# EAGLE schematic Valve_with_oc (EAGLE 8.2.2)
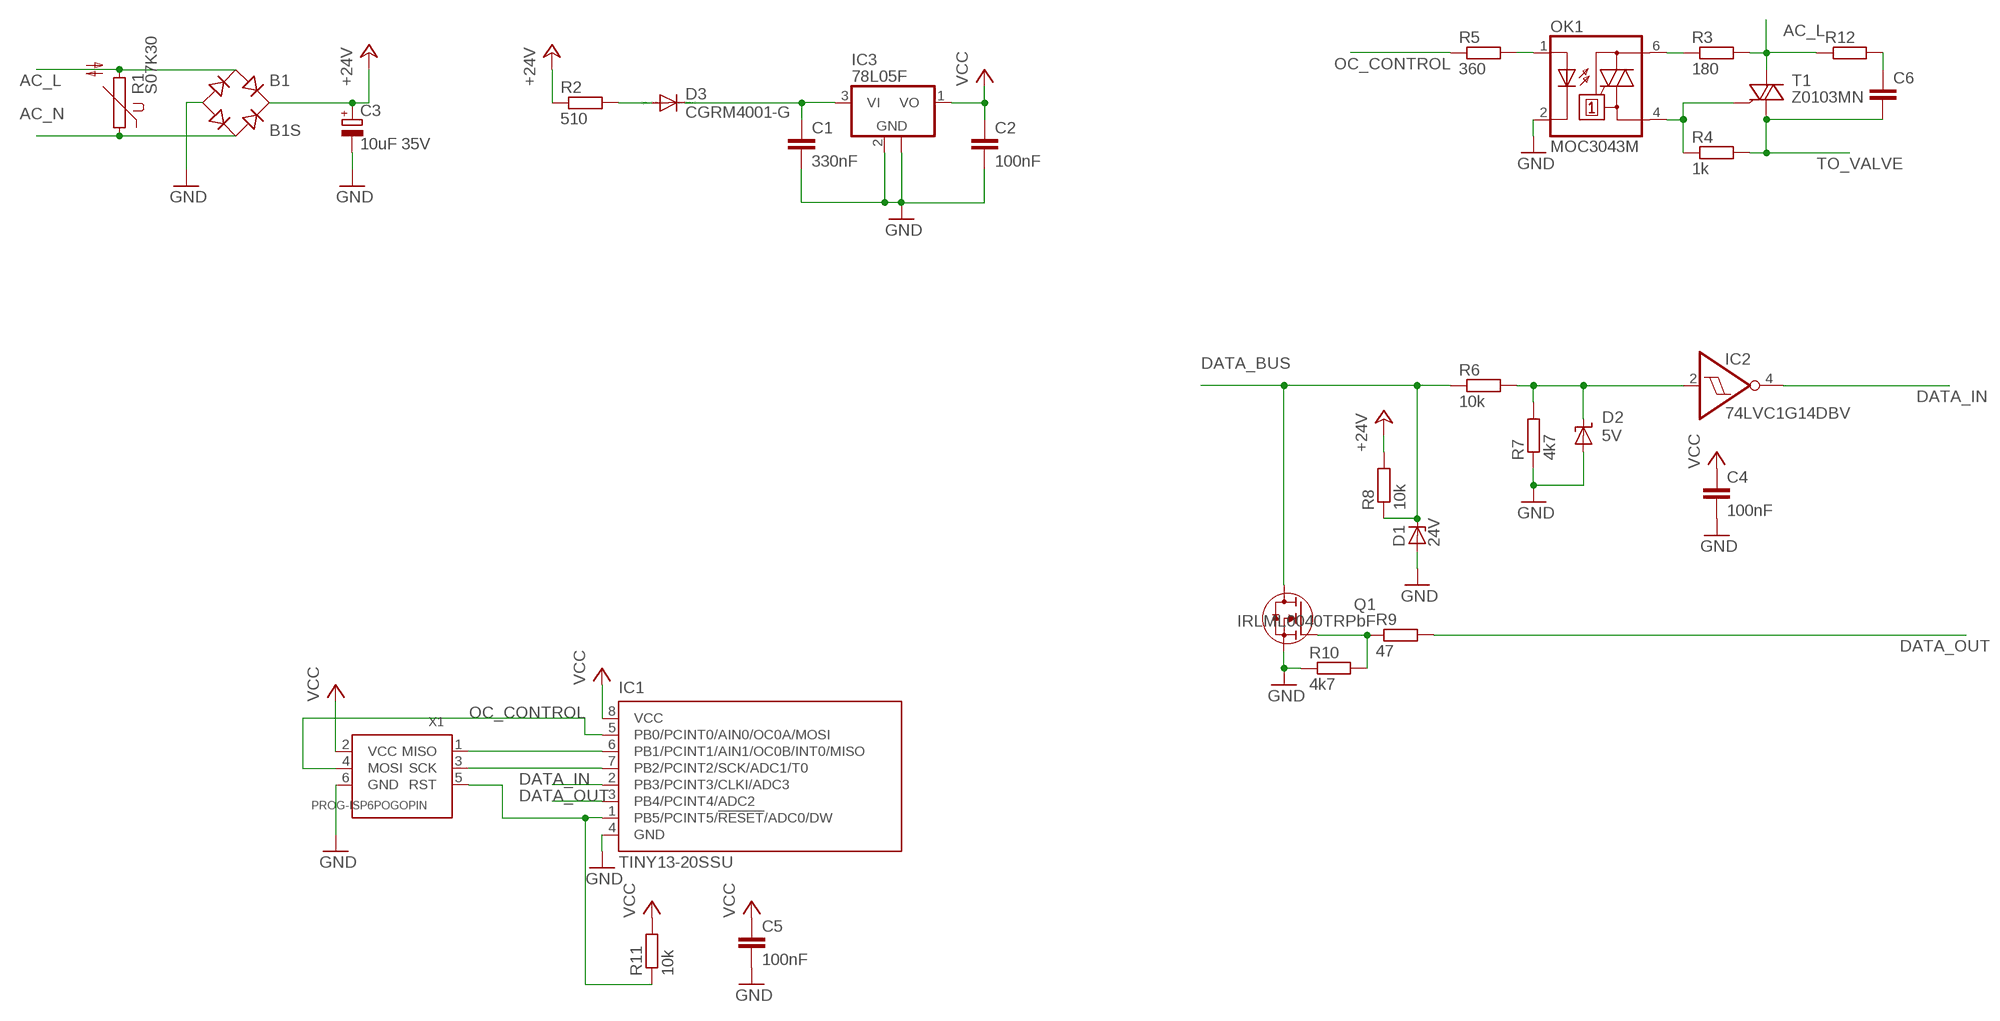
[diagram p0: schematic, sheet 1]

## Parts
B1  B1S  [MBS]
C1  330nF  C-EUC0805K  [C0805K]
C2  100nF  C-EUC0805K  [C0805K]
C3  10uF 35V  CPOL-EUC/6032-28R  [C/6032-28R]
C4  100nF  C-EUC0805K  [C0805K]
C5  100nF  C-EUC0805K  [C0805K]
C6  C-EUC0805K  [C0805K]
D1  24V  ZENER-DIODESOT23  [SOT23]
D2  5V  ZENER  [SOD123]
D3  CGRM4001-G  [SOD-123_MINI-SMA]
IC1  TINY13-20SSU  [8S1]
IC2  74LVC1G14DBV  [SOT23-5]
IC3  78L05F  [SOT89]
OK1  MOC3043M  [DIL06]
Q1  IRLML0040TRPbF  SI2302  [SOT-23-GSD]
R1  S07K30  S07K40  [S07K40]
R2  510  R-EU_R2512  [R2512]
R3  180  R-EU_R0805  [R0805]
R4  1k  R-EU_R0805  [R0805]
R5  360  R-EU_R0805  [R0805]
R6  10k  R-EU_R0805  [R0805]
R7  4k7  R-EU_R0805  [R0805]
R8  10k  R-EU_R0805  [R0805]
R9  47  R-EU_R0805  [R0805]
R10  4k7  R-EU_R0805  [R0805]
R11  10k  R-EU_R0805  [R0805]
R12  R-EU_R0805  [R0805]
T1  Z0103MN  [SOT223]
X1  PROG-ISP6POGOPIN  [PROG_POGOPIN]

## Nets
+24V: B1.+ C3.+ R2.1 R8.2
AC_L: B1.AC1 R1.2 R3.2 R12.1 T1.2(A2) T1.4(A2)
AC_N: B1.AC2 R1.1
DATA_BUS: D1.3(C) Q1.D R6.1 R8.1
DATA_IN: IC1.2(PB3/PCINT3/CLKI/ADC3) IC2.4(O)
DATA_OUT: IC1.3(PB4/PCINT4/ADC2) R9.2
GND: B1.- C1.2 C2.2 C3.- C4.2 C5.2 D1.1(A) D2.A IC1.4(GND) IC3.2(GND) IC3.2@1(GND) OK1.2(C) Q1.S R7.1 R10.1 X1.6(GND)
N$1: C1.1 D3.C IC3.3(VI)
N$2: D3.A R2.2
N$3: OK1.6(A2) R3.1
N$4: OK1.4(A1) R4.1 T1.3(G)
N$5: OK1.1(A) R5.2
N$6: D2.C IC2.2(I) R6.2 R7.2
N$7: Q1.G R9.1 R10.2
N$8: IC1.1(PB5/PCINT5/!RESET!/ADC0/DW) R11.1 X1.5(RST)
N$9: C6.1 R12.2
N$10: IC1.6(PB1/PCINT1/AIN1/OC0B/INT0/MISO) X1.1(MISO)
N$11: IC1.7(PB2/PCINT2/SCK/ADC1/T0) X1.3(SCK)
OC_CONTROL: IC1.5(PB0/PCINT0/AIN0/OC0A/MOSI) R5.1 X1.4(MOSI)
TO_VALVE: C6.2 R4.2 T1.1(A1)
VCC: C2.1 C4.1 C5.1 IC1.8(VCC) IC3.1(VO) R11.2 X1.2(VCC)

## Power pins joined to a net without a drawn wire
GND: IC2.3(GND)
VCC: IC2.5(VCC)

## Library data of the parts
B1 = rectifier:B*S: Surface Mount Glass Passivated Bridge Rectifiers Source: Comchip Bridge Rectifiers B05S-G_B10S-G.pdf
C1 C2 C4-C6 = rcl:C-EU: CAPACITOR, European symbol
C3 = rcl:CPOL-EU: POLARIZED CAPACITOR, European symbol
D1 = diode:ZENER-DIODE: Z-Diode
D2 = usb:ZENER
D3 = diode:CGRM400*-G: Molded plasitc,JEDEC SOD-123/Mini SMA Source: Comchip CGRM4001-G.pdf
IC1 = atmel:TINY13: 8-bit AVR Microcontroller with 1K Bytes In-System Programmable Flash Source: http://www.atmel.com/dyn/resources/prod_documents/2535S.pdf; MPN: ATTINY13-20SSU; OC_FARNELL: 1455133; OC_NEWARK: 58M3771
IC2 = 74xx-little-de:74*1G14: Single Schmitt-Trigger Inverter Gate
IC3 = linear:78L*: POSITOIV-VOLTAGE REGULATORS Output up to 100 mA Source: Datasheet <http://focus.ti.com/lit/ds/symlink/ua78l05.pdf>
OK1 = optocoupler:MOC30*: 6-Pin DIP Zero-Cross Optoisolators Triac Driver Output (250/400 Volt Peak) Source: Data sheet <http://www.fairchildsemi.com/ds/MO/MOC3031M.pdf> The old path of data sheet not more available 2013-05-06.; MF: FAIRCHILD SEMICONDUCTOR; MPN: MOC3043-M; OC_FARNELL: 1021371; OC_NEWARK: 72K8900
Q1 = usb:SI2302: N-канальный полевик
R1 = varistor:S07K40: VARISTOR
R2-R12 = rcl:R-EU_: RESISTOR, European symbol
T1 = usb:Z0103MN
X1 = usb:PROG-ISP